# Altium schematic sheet RELAY15.SchDoc
size A
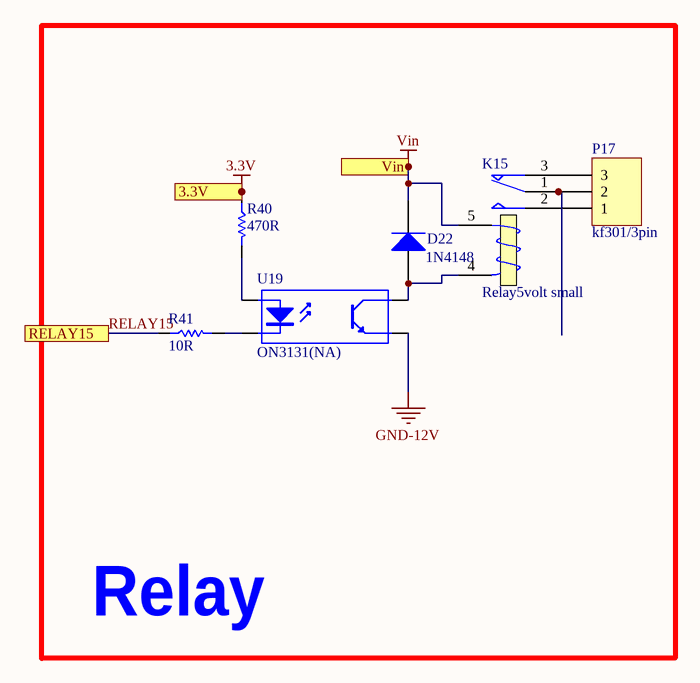
[diagram p0: RELAY15.SchDoc]

## Parts
D22  1N4148  [sod123]
K15  Relay5volt small  [relay5_childern]
P17  kf301/3pin  [Blue Connector 1*3 -kf301]
R40  470R  [0805/resistor]
R41  10R  [0805/resistor]
U19  ON3131(NA)  [OPTO_COUPLER]

## Blocks framed on the sheet
Relay: D22 K15 P17 R40 R41 U19

## Ports
3.3V, RELAY15, Vin

## Nets
3.3V: R40.1 ; port 3.3V
GND-12V: U19.3(E)
Vin: D22.K K15.5 ; port Vin
RELAY15: R41.1 ; port RELAY15
NetD22_A: D22.A K15.4(T2) U19.4(C)
NetK15_1: K15.1(COM) P17.2
NetK15_2: K15.2(NO) P17.1
NetK15_3: K15.3(T1) P17.3
NetR40_2: R40.2 U19.1(A)
NetR41_2: R41.2 U19.2(K)

## Library data of the parts
D22 = Diode 1N4007: 1 Amp General Purpose Rectifier; Published: 8-Jun-2000; LatestRevisionDate: 17-Jul-2002; LatestRevisionNote: Re-released for DXP Platform.; DatasheetVersion: 1998; PackageVersion: Aug-1999; PackageReference: DO-41; Publisher: Altium Limited; PackageDescription: Diode, Axial; Body 5.2 x 2.7 mm (LxDia. max), Lead Dia. 0.86 mm (max); Code_JEDEC: DO-204-AL; ComponentLink1Description: Manufacturer Link; ComponentLink1URL: http://www.fairchildsemi.com/; ComponentLink2Description: Datasheet; ComponentLink2URL: http://www.fairchildsemi.com/ds/1N%2F1N4001.pdf
K15 = Relay: SPDT Relay; Published: 8-Jun-2000; LatestRevisionDate: 17-Jul-2002; LatestRevisionNote: Re-released for DXP Platform.; PackageReference: MODULE5B; Publisher: Altium Limited
P17 = Header 3: LatestRevisionDate: 17-Jul-2002; LatestRevisionNote: Re-released for DXP Platform.; Publisher: Altium Limited
R40 R41 = Resistor: Tolerance: 5%; Power: 1/8 W
  R40: Value: 470R
  R41: Value: 10R
U19 = Optoisolator1: 4-Pin Phototransistor Optocoupler; Published: 24-Mar-1999; LatestRevisionDate: 04-Mar-2005; LatestRevisionNote: Sch pins 3 & 4 Swapped.; DatasheetVersion: Nov-2003; PackageReference: DIP-4; Publisher: Altium Limited